# EAGLE design TC2030-MCP-NL-Adapter (EAGLE 9.6.2)
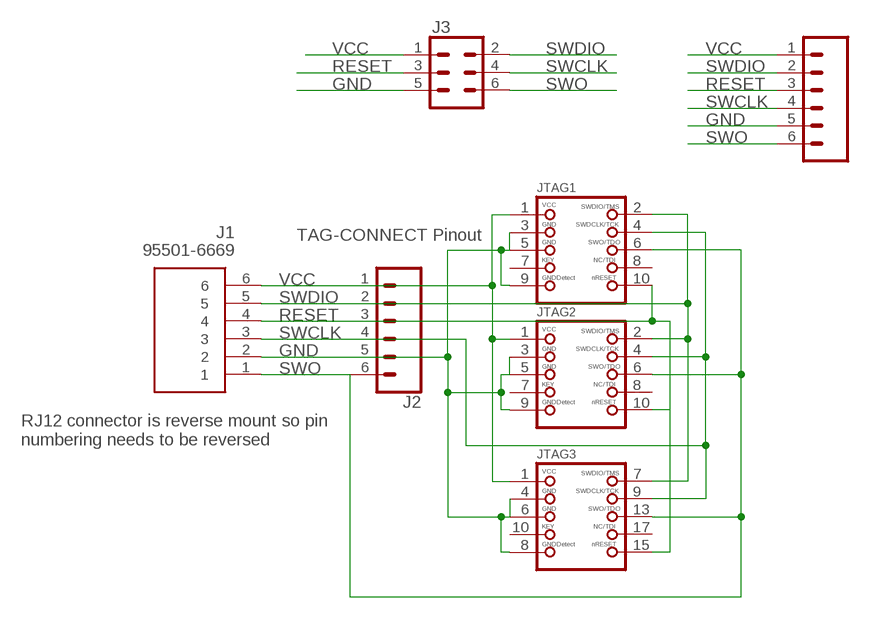
[diagram p0: schematic, sheet 1]

## Parts
J1  95501-6669  [95501-6669]
J2  CONN_06SILK_FEMALE_PTH  [1X06]
J3  CONN_03X2NO_SILK  [2X3-NS]
J6  CONN_06SILK_FEMALE_PTH  [1X06]
JTAG1  JTAG-CORTEXM3  [2X05_1.27MM_SMT]
JTAG2  JTAG-CORTEXM3MOLEX  [CORTEXM3_SWD10_MOLEX]
JTAG3  JTAG-CORTEXM3MOLEX20  [JTAG-ARM]

## Nets
GND: J1.2 J2.5 J3.5 J6.5 JTAG1.3 JTAG1.5 JTAG1.9 JTAG2.3 JTAG2.5 JTAG2.9 JTAG3.4 JTAG3.6 JTAG3.8
RESET: J1.4 J2.3 J3.3 J6.3 JTAG1.10 JTAG2.10 JTAG3.15
SWCLK: J1.3 J2.4 J3.4 J6.4 JTAG1.4 JTAG2.4 JTAG3.9
SWDIO: J1.5 J2.2 J3.2 J6.2 JTAG1.2 JTAG2.2 JTAG3.7
SWO: J1.1 J2.6 J3.6 J6.6 JTAG1.6 JTAG2.6 JTAG3.13
VCC: J1.6 J2.1 J3.1 J6.1 JTAG1.1 JTAG2.1 JTAG3.1
Unconnected: JTAG1.7 JTAG1.8 JTAG2.7 JTAG2.8 JTAG3.10 JTAG3.17

## Notes on the sheet
- TAG-CONNECT Pinout
- RJ12 connector is reverse mount so pin
  numbering needs to be reversed

## Library data of the parts
J1 = SamacSys_Parts:95501-6669: Molex Cat5e 6P/6C Right Angle Surface Mount Female RJ12 UTP RJ12 Connector Source: Datasheet <http://www.molex.com/webdocs/datasheets/pdf/en-us//0955016669_MODULAR_JACKS_PLUG.pdf>; DESCRIPTION: Molex Cat5e 6P/6C Right Angle Surface Mount Female RJ12 UTP RJ12 Connector; HEIGHT: mm; MANUFACTURER_NAME: Molex; MANUFACTURER_PART_NUMBER: 95501-6669; MOUSER_PART_NUMBER: 538-95501-6669; MOUSER_PRICE-STOCK: https://www.mouser.co.uk/ProductDetail/Molex/95501-6669?qs=KUIzHt%2Fe91nGEpACmwALwA%3D%3D
J2 J6 = SparkFun-Connectors:CONN_06: Multi connection point. Often used as Generic Header-pin footprint for 0.1 inch spaced/style header connections On any of the 0.1 inch spaced packages, you can populate with these: Break Away Headers - Straight <https://www.sparkfun.com/products/116> (PRT-00116) Break Away Male Headers - Right Angle <https://www.sparkfun.com/products/553> (PRT-00553) Female Headers <https://www.sparkfun.com/products/115> (PRT-00115) Break Away Headers - Machine Pin <https://www.sparkfun.com/products/117> (PRT-00117) Break Away Female Headers - Swiss Machine Pin <https://www.sparkfun.com/products/743> (PRT-00743) Arduino Stackable Header - 6 Pin <https://www.sparkfun.com/products/9280> (PRT-09280) For SCREWTERMINALS and SPRING TERMINALS visit here: Screw Terimnals on SparkFun.com <https://www.sparkfun.com/search/results?term=Screw+Terminals> (5mm/3.5mm/2.54mm spacing) This device is also useful as a general connection point to wire up your design to another part of your project. Our various solder wires solder well into these plated through hole pads. Hook-Up Wire - Assortment (Stranded, 22 AWG) <https://www.sparkfun.com/products/11375> (PRT-11375) Hook-Up Wire - Assortment (Solid Core, 22 AWG) <https://www.sparkfun.com/products/11367> (PRT-11367) View the entire wire category on our website here <https://www.sparkfun.com/categories/141>; PROD_ID: CONN-08437
J3 = SparkFun-Connectors:CONN_03X2: Multi connection point. Often used as Generic Header-pin footprint for 0.1 inch spaced/style header connections You can populate with any combo of single row headers, but if you'd like an exact match, check these: Header - 2x3 (Male, 0.1") <https://www.sparkfun.com/products/12807> (PRT-12807) Header - 2x3 (Female, 0.1") <https://www.sparkfun.com/products/13010> (PRT-13010) 2x3 Pin Shrouded Header <https://www.sparkfun.com/products/10877> (PRT-10877) On any of the 0.1 inch spaced packages, you can populate with these: Break Away Headers - Straight <https://www.sparkfun.com/products/116> (PRT-00116) Break Away Male Headers - Right Angle <https://www.sparkfun.com/products/553> (PRT-00553) Female Headers <https://www.sparkfun.com/products/115> (PRT-00115) Break Away Headers - Machine Pin <https://www.sparkfun.com/products/117> (PRT-00117) Break Away Female Headers - Swiss Machine Pin <https://www.sparkfun.com/products/743> (PRT-00743) Special note: the shrouded connector mates well with our 3x2 ribbon cables: Ribbon Crimp Connector - 6-pin (2x3, Female) <https://www.sparkfun.com/products/10651> (PRT-10651) Ribbon Cable - 6 wire (15ft) <https://www.sparkfun.com/products/10646> (PRT-10646)
JTAG1-JTAG3 = microbuilder:JTAG-CORTEXM3: Serial Wire (SW-DP) Connector This standard 0.05" 10-pin connector is for use with the Cortex M0/M3's native SWD (serial wire debugger) interface (SW-DP). Some boards support a 20-pin combined JTAG+SWD connector (SWJ-DP), such as the LPC1700 family, but many smaller devices only work with SWD which typically use the smaller 10-pin SW-DP connecter (the LPC1300 family, for example, only supports SWD). 2x05 1.27mm/0.05" Connector: This is the standard SMT connector defined by ARM for all Cortex devices, and should be used in most situations and for forward-compatibility since any new devices coming to market will likely use this connector. MOLEX 10 Pin 0.1" Connector: This 0.1" 10 pin connector has the same pin layout as the standard 0.05" connector, but is easier to work with if you are using standard jumper wires or custom cables to connect your SWD hardware. MOLEX 20 Pin 0.1" Connector: This 0.1" 20 pin connector is the same model used for ARM7/ARM9 JTAG debuggers, but is connected to match the pins on the Segger J-Link for ARM (which supports both JTAG and SWD debugging). See the following document from ARM for more information on Cortex M3 Debug Connectors: http://infocenter.arm.com/help/topic/com.arm.doc.faqs/attached/13634/cortex_debug_connectors.pdf And the following page for an overview with images of the different connector types: http://www.keil.com/peripherals/coresight/connectors.asp

## Board
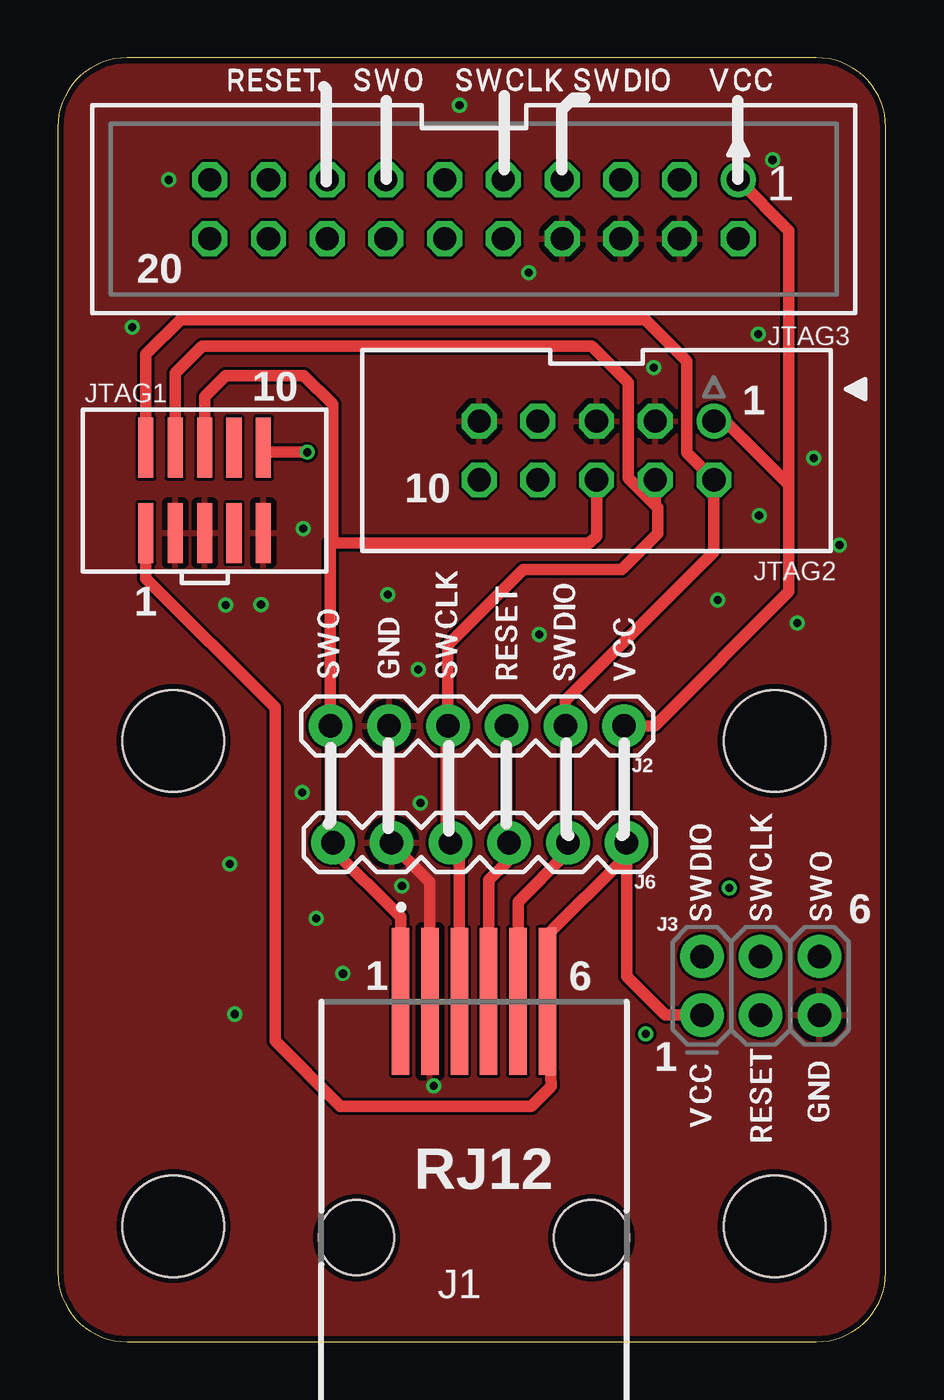
[diagram p1: board, top side]
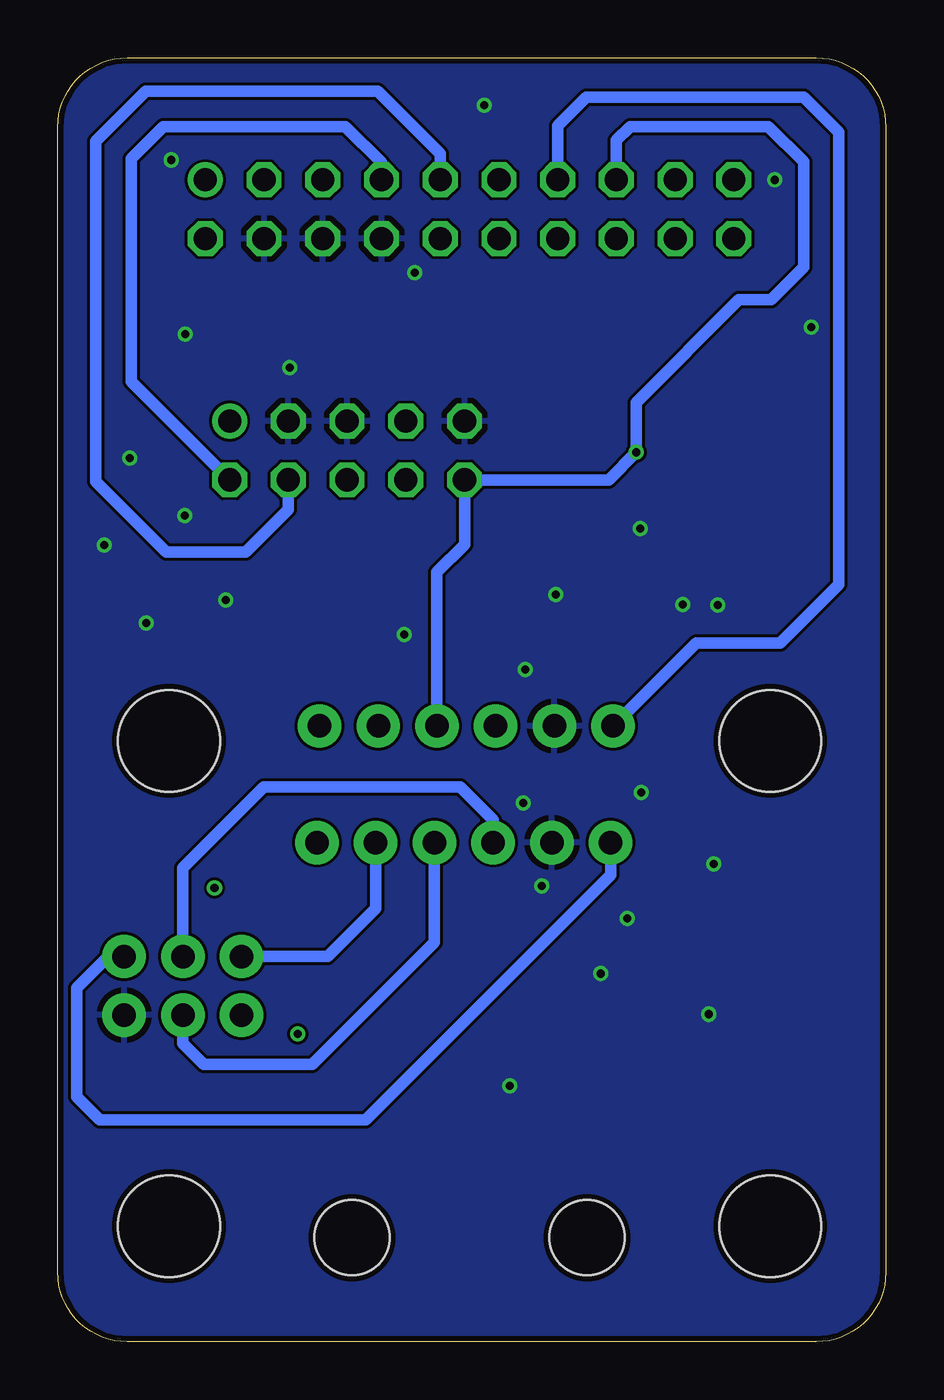
[diagram p2: board, bottom side, seen from below]

Size 35.81 x 55.55 mm. Coordinates in mm from the lower left corner, seen from the top.
Outline: 0,52.55 0,3 arc90 3,0 32.81,0 arc90 35.81,3 35.81,52.55 arc90 32.81,55.55 3,55.55 arc90 0,52.55
Copper layers (1*16): Top 0.035mm / dielectric 0.8mm / Bottom 0.035mm
Design rules "jlc-2layer": minimum track width 6mil, minimum drill 0.3mm, track to track 5mil, track to pad 5mil, pad to pad 5mil, via to via 5mil, smd to smd 0mil, copper to edge 0.25mm, drill to drill 10mil, minimum pad ring 10mil, minimum via ring 0.15mm, stop-mask expansion 2mil, vias tented up to drill 100mil, thermal gap 10mil
Holes 4.4 mm at 5,5 31,5 5,26 31,26

### Footprints (pad centres in the part's own frame; a part is rotated, then mirrored left to right if it is on the bottom)
95501-6669 = smd 0.76 x 6.35: 1 -3.175,10.225; 2 -1.905,10.225; 3 -0.635,10.225; 4 0.635,10.225; 5 1.905,10.225; 6 3.175,10.225 | hole 3.25: -5.08,0; 5.08,0
1X06 = drill 1.016 pad 1.88: 1 0,0; 2 2.54,0; 3 5.08,0; 4 7.62,0; 5 10.16,0; 6 12.7,0
2X3-NS = drill 1.016 pad 1.88: 1 -2.54,-1.27; 2 -2.54,1.27; 3 0,-1.27; 4 0,1.27; 5 2.54,-1.27; 6 2.54,1.27
2X05_1.27MM_SMT = smd 0.65 x 2.6: 1 -2.54,-1.85; 2 -2.54,1.85; 3 -1.27,-1.85; 4 -1.27,1.85; 5 0,-1.85; 6 0,1.85; 7 1.27,-1.85; 8 1.27,1.85; 9 2.54,-1.85; 10 2.54,1.85
CORTEXM3_SWD10_MOLEX = drill 1: 1 -5.08,-1.27 | drill 1 octagon: 2 -5.08,1.27; 3 -2.54,-1.27; 4 -2.54,1.27; 5 0,-1.27; 6 0,1.27; 7 2.54,-1.27; 8 2.54,1.27; 9 5.08,-1.27; 10 5.08,1.27
JTAG-ARM = drill 1: 1 -11.43,-1.27 | drill 1 octagon: 2 -11.43,1.27; 3 -8.89,-1.27; 4 -8.89,1.27; 5 -6.35,-1.27; 6 -6.35,1.27; 7 -3.81,-1.27; 8 -3.81,1.27; 9 -1.27,-1.27; 10 -1.27,1.27; 11 1.27,-1.27; 12 1.27,1.27; 13 3.81,-1.27; 14 3.81,1.27; 15 6.35,-1.27; 16 6.35,1.27; 17 8.89,-1.27; 18 8.89,1.27; 19 11.43,-1.27; 20 11.43,1.27

### Placement (x,y rotation side)
J1  18,4.5 0 top
J2  24.49,26.64 180 top
J3  30.4,15.4 0 top
J6  24.6,21.6 180 top
JTAG1  6.35,36.83 0 top
JTAG2  23.3,38.56 180 top
JTAG3  18,49 180 top
U$1  [SWO0]  11.7,28 90 top
U$2  [GND0]  14.3,28 90 top
U$3  [SWCLK0]  16.8,28 90 top
U$4  [RESET0]  19.4,27.9 90 top
U$5  [SWDIO0]  21.9,27.9 90 top
U$6  [VCC0]  24.5,27.9 90 top
U$7  [SWO0]  12.1,54.6 0 top
U$8  [SWDIO0]  21.6,54.6 0 top
U$9  [RESET0]  6.6,54.6 0 top
U$10  [VCC0]  27.5,54.6 0 top
U$11  [SWCLK0]  16.5,54.6 0 top
U$12  [SWO0]  33,17.5 90 top
U$13  [RESET0]  30.4,7.9 90 top
U$14  [VCC0]  27.8,8.6 90 top
U$15  [GND0]  32.9,8.8 90 top
U$16  [SWCLK0]  30.4,17.5 90 top
U$17  [SWDIO0]  27.8,17.5 90 top

### Tracks (layer width: path | path; a pad name or v marks a point on that pad's centre or on a via)
GND  (via drill 0.35)
  Top 0.152: J6.5 14.38,21.6 14.33,21.65
  Top 0.508: J2.5 14.33,21.65 16.09,19.88 J1.2
  other vias: 25.78,42.14 14.27,32.33 8.79,31.9 10.62,35.18 3.23,43.89 20.37,46.25 17.37,53.49 4.8,50.27 30.91,51.13 30.3,43.59 31.98,31.09 33.81,34.47 32.69,38.23 30.33,35.74 28.54,32.09 20.83,30.6 15.6,29.08 12.33,15.93 10.58,23.77 16.26,11.07 11.19,18.32 7.44,20.68 7.65,14.17 7.26,31.88 14.89,19.72 15.69,23.32
  pour Top: -1.78,59.31 -1.78,-2.72 38.1,-2.72 38.1,57.61 38.02,57.61 38.02,59.31
  pour Bottom: -3.66,60.68 -3.66,-5.26 40.08,-5.26 40.08,60.68
GND1  (via drill 0.35)
  other vias: 29.03,19.63
GND2  (via drill 0.35)
  other vias: 25.43,13.33
RESET  (via drill 0.35)
  Top 0.152: J6.3 19.41,21.7
  Top 0.508: J2.3 19.41,21.7 19.41,20.74 18.64,19.97 J1.4 | v10.79,38.48 9.09,38.48 JTAG1.10
  Bottom 0.508: J2.3 19.41,33.3 18.22,34.48 JTAG2.10 11.99,37.29 v10.79,38.48 10.79,40.64 6.35,45.09 4.95,45.09 3.56,46.48 3.56,51.05 5.08,52.58 11.05,52.58 11.65,51.98 JTAG3.15 | J6.3 19.52,17.28 24.8,12 29.5,12 30.4,12.9 J3.3
SWCLK
  Top 0.152: J6.4
  Top 0.508: 25.84,36.19 JTAG2.4 | JTAG1.4 5.08,41.91 6.25,43.08 23.09,43.08 24.66,41.5 24.66,37.37 25.84,36.19 | 25.84,36.19 25.94,36.09 25.94,34.96 24.38,33.4 20.12,33.4 16.87,30.15 J2.4 16.79,26.56 16.79,21.79 J6.4 17.36,21.22 J1.3
  Bottom 0.508: JTAG3.9 19.27,51.4 21.97,54.1 32,54.1 34.16,51.94 34.16,37.21 31.11,34.16 27.69,34.16 25.84,36.01 JTAG2.4 | J6.4 16.98,22.58 18.4,24 26.9,24 30.4,20.5 J3.4
SWDIO
  Top 0.152: J6.2 21.95,21.6
  Top 0.508: JTAG1.2 3.81,42.72 5.31,44.22 25.4,44.22 27.2,42.42 27.2,38.47 JTAG2.2 28.38,34.16 21.95,27.73 J2.2 21.95,21.6 21.95,21.08 19.91,19.03 J1.5
  Bottom 0.508: JTAG3.7 21.81,51.02 23.37,52.58 31.24,52.58 32.64,51.18 32.64,41.55 JTAG2.2 | J6.2 22.06,18.74 24.13,16.67 J3.2
SWO
  Top 0.152: J6.6 11.9,21.52 11.79,21.41
  Top 0.508: 11.89,34.54 11.89,40.56 10.64,41.81 7.26,41.81 6.35,40.89 JTAG1.6 | JTAG2.6 23.3,34.86 22.99,34.54 11.89,34.54 | 11.89,34.54 11.79,34.54 J2.6 11.79,21.41 14.82,18.38 J1.1
  Bottom 0.508: JTAG3.13 14.19,52.61 12.95,53.85 3.56,53.85 2.03,52.32 2.03,32.77 4.57,30.23 8.2,30.23 J2.6 | J6.6 11.9,20.2 22.5,9.6 34,9.6 35,10.6 35,15.3 33.63,16.67 J3.6
VCC
  Top 0.152: J6.1 24.49,21.6
  Top 0.508: JTAG1.1 3.81,33.02 9.4,27.43 9.4,13.01 12.22,10.19 20.47,10.19 21.34,11.05 J1.6 21.18,17.6 24.49,20.91 24.49,21.6 J2.1 25.81,26.64 31.62,32.45 31.62,37.08 | 31.62,37.08 28.88,39.83 JTAG2.1 | JTAG3.1 31.62,48.08 31.62,37.08 | J6.1 24.6,15.8 26.27,14.13 J3.1

### Text on the board
tPlace: 20 | 10 | 1 | 10 | 1 | 6 | 1 | 6 | 1 | RJ12